# Altium schematic sheet FaceID_Look.schdoc: PC-104 16 bit bus
size B; Organization: Organization; Address1: Address1; Address2: Address2; Address3: Address3; Address4: Address4; DocumentNumber: 1; Revision: 0; SheetNumber: 2; SheetTotal: 2
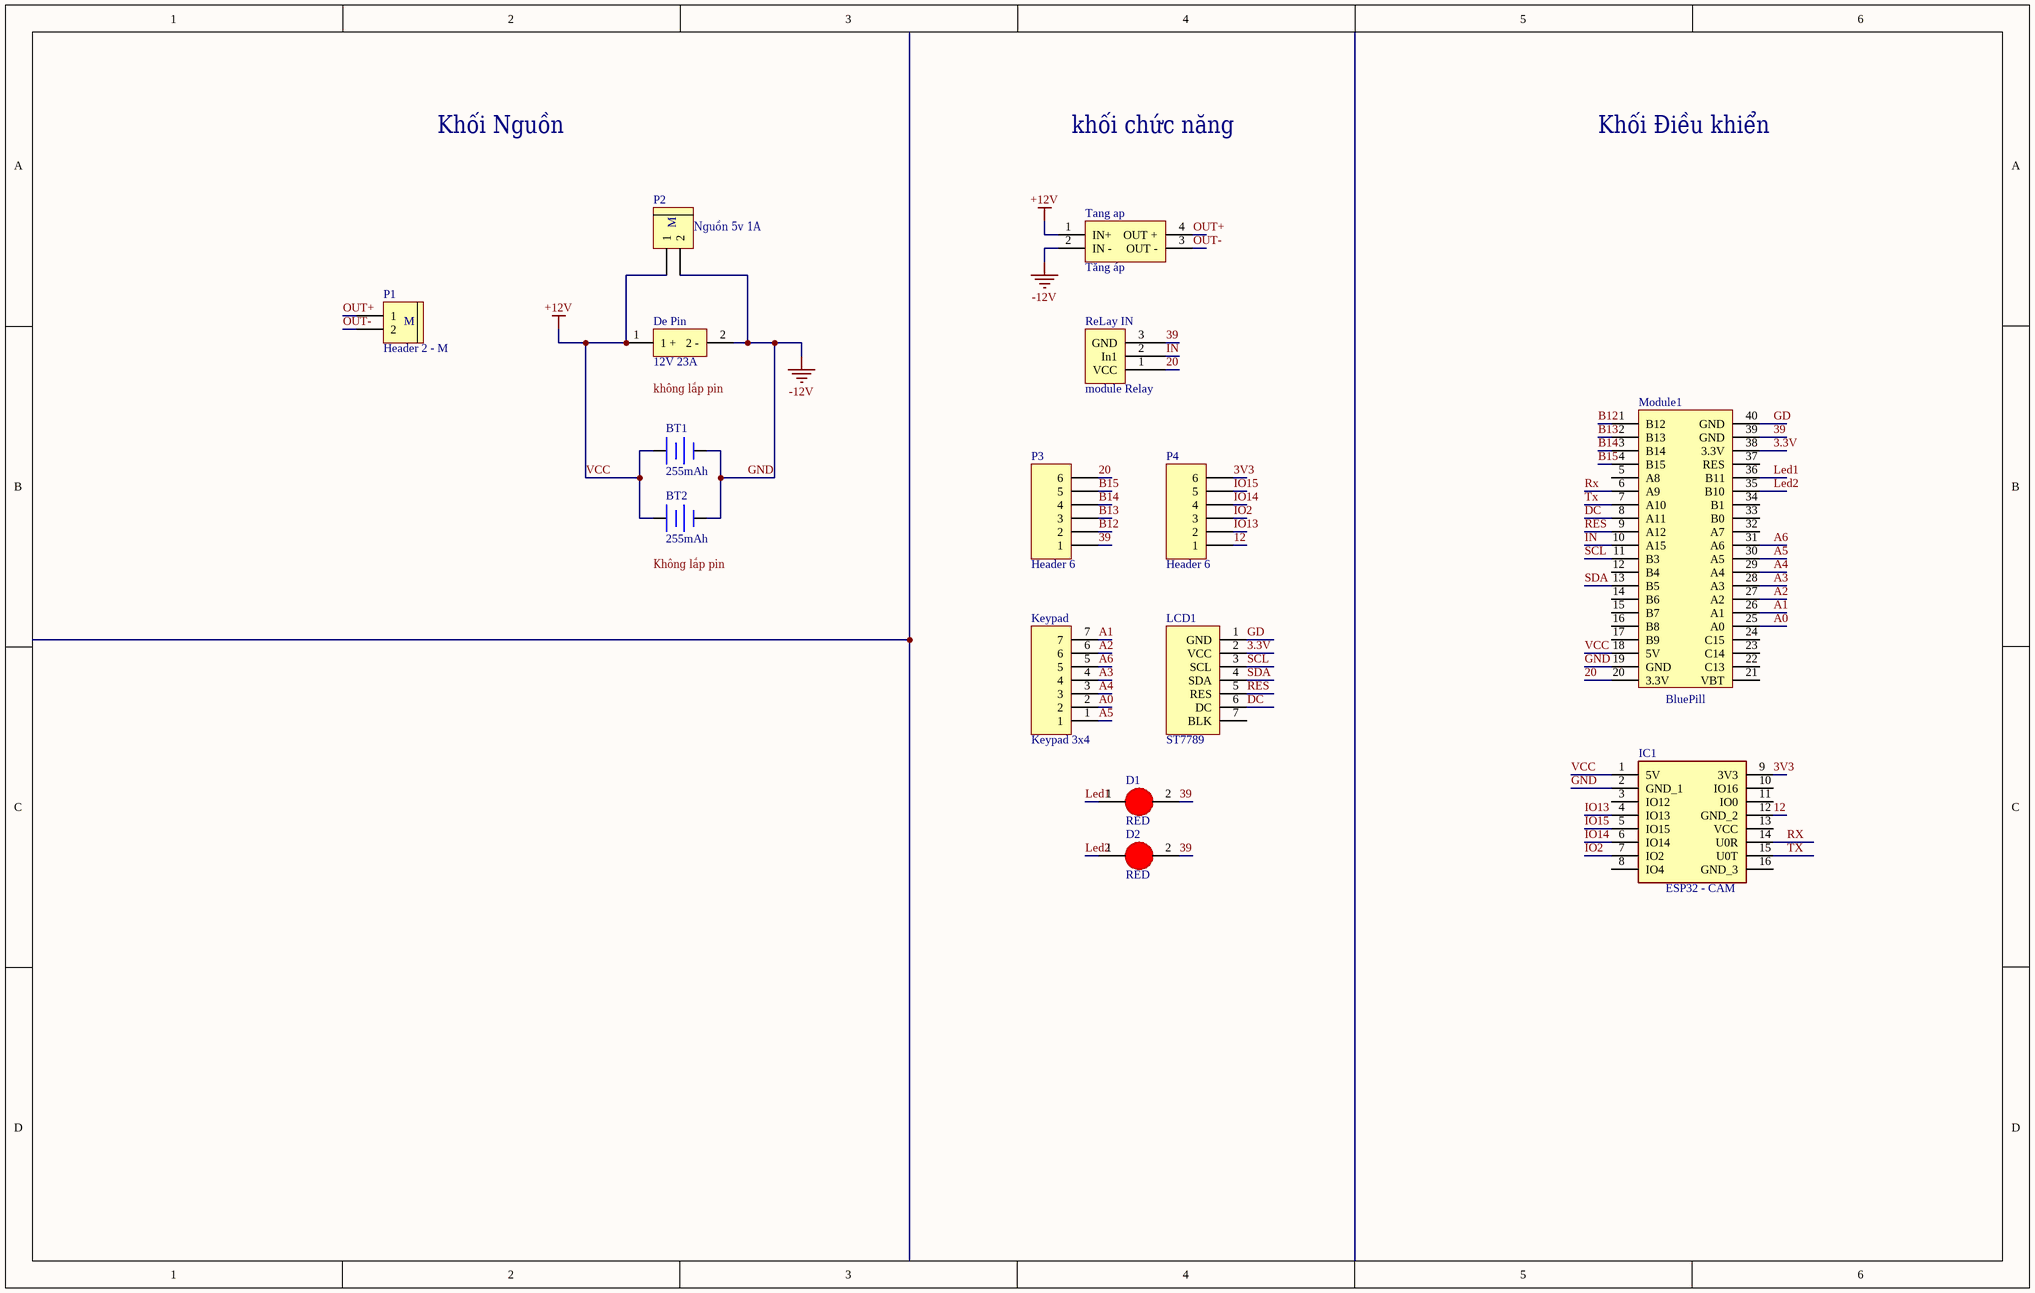
[diagram p0: FaceID_Look.schdoc]

## Parts
BT1  255mAh  [BATTERY_CR2032 SMD]
BT2  255mAh  [BATTERY_CR2032 SMD]
D1  RED  [LED_5MM]
D2  RED  [LED_5MM]
De_Pin  12V 23A  [DePin]
IC1  ESP32 - CAM  [113990580]
Keypad  Keypad 3x4  [Keypad 3x4]
LCD1  ST7789  [ST7789]
Module1  BluePill  [Blue_PIll]
P1  Header 2 - M  [Medium - Header 2]
P2  Nguồn 5v 1A  [Medium - Header 2]
P3  Header 6  [HDR1X6]
P4  Header 6  [HDR1X6]
ReLay_IN  module Relay  [Module relay]
Tang_ap  Tăng áp  [Tang ap]

## Nets
GND: BT1.2(-) BT2.2(-) De_Pin.2(2_-) IC1.2(GND_1) Module1.19(GND) P2.2 Tang_ap.2(IN_-)  [also labelled -12V]
VCC: BT1.1(+) BT2.1(+) De_Pin.1(1_+) IC1.1(5V) Module1.18(5V) P2.1 Tang_ap.1(IN+)  [also labelled +12V]
3.3V: LCD1.2(VCC) Module1.38(3.3V)
3V3: IC1.9(3V3) P4.6
12: IC1.12(GND_2) P4.1
20: Module1.20(3.3V) P3.6 ReLay_IN.1(VCC)
39: D1.2(K) D2.2(K) Module1.39(GND) P3.1 ReLay_IN.3(GND)
A0: Keypad.2 Module1.25(A0)
A1: Keypad.7 Module1.26(A1)
A2: Keypad.6 Module1.27(A2)
A3: Keypad.4 Module1.28(A3)
A4: Keypad.3 Module1.29(A4)
A5: Keypad.1 Module1.30(A5)
A6: Keypad.5 Module1.31(A6)
B12: Module1.1(B12) P3.2
B13: Module1.2(B13) P3.3
B14: Module1.3(B14) P3.4
B15: Module1.4(B15) P3.5
DC: LCD1.6(DC) Module1.8(A11)
GD: LCD1.1(GND) Module1.40(GND)
IN: Module1.10(A15) ReLay_IN.2(In1)
IO2: IC1.7(IO2) P4.3
IO13: IC1.4(IO13) P4.2
IO14: IC1.6(IO14) P4.4
IO15: IC1.5(IO15) P4.5
Led1: D1.1(A) Module1.36(B11)
Led2: D2.1(A) Module1.35(B10)
OUT+: P1.1 Tang_ap.4(OUT_+)
OUT-: P1.2 Tang_ap.3(OUT_-)
RES: LCD1.5(RES) Module1.9(A12)
RX: IC1.14(U0R) Module1.6(A9)
SCL: LCD1.3(SCL) Module1.11(B3)
SDA: LCD1.4(SDA) Module1.13(B5)
TX: IC1.15(U0T) Module1.7(A10)

Not connected (* = marked no-connect by the designer): IC1 3(IO12) 8(IO4) 10(IO16) 11(IO0) 13(VCC) 16(GND_3); LCD1 7(BLK); Module1 5(A8) 12(B4) 14(B6) 15(B7) 16(B8) 17(B9) 21(VBT) 22(C13) 23(C14) 24(C15) 32(A7) 33(B0) 34(B1) 37(RES)

## Notes on the sheet
- Labels drawn without touching a wire or pin: không lắp pin, Không lắp pin, khối chức năng, Khối Nguồn, Khối Điều khiển
- (in symbol Header 2 - M) M

## Library data of the parts
BT1 BT2 = CR-2032/F2N: BATTERY LITHIUM 3V 225mAh COIN 20MM; Solder: HAND; CompanyID: VT-01026; MPN: CR-2032/F2N; Value: 255mAh
D1 D2 = LED RED 5mm: Solder: WAVE; Value: RED; Category: *
De_Pin = Depin
IC1 = 113990580: Integrated Circuit; Manufacturer_Name: Seeed Studio; Datasheet Link: https://github.com/SeeedDocument/Outsourcing/raw/master/113990580%20ESP32-CAM/113990580%20ESP32-CAM%20Product%20Specification.pdf; Height: 3mm; Manufacturer_Part_Number: 113990580; Mouser Part Number: 713-113990580; Mouser Price/Stock: https://www.mouser.com/Search/Refine.aspx?Keyword=713-113990580; Arrow Part Number: 113990580; Arrow Price/Stock: https://www.arrow.com/en/products/113990580/seeed-technology-limited
LCD1 = LCD ST7789
Module1 = Blue Pill
P1 P2 = Header 2 - M: Header, 2-Pin, Medium; LatestRevisionDate: 17-Jul-2002; LatestRevisionNote: Re-released for DXP Platform.; Publisher: Altium Limited
P3 P4 = Header 6: Header, 6-Pin; Solder: WAVE